# EAGLE design rgbLightsController (EAGLE 8.6.3)
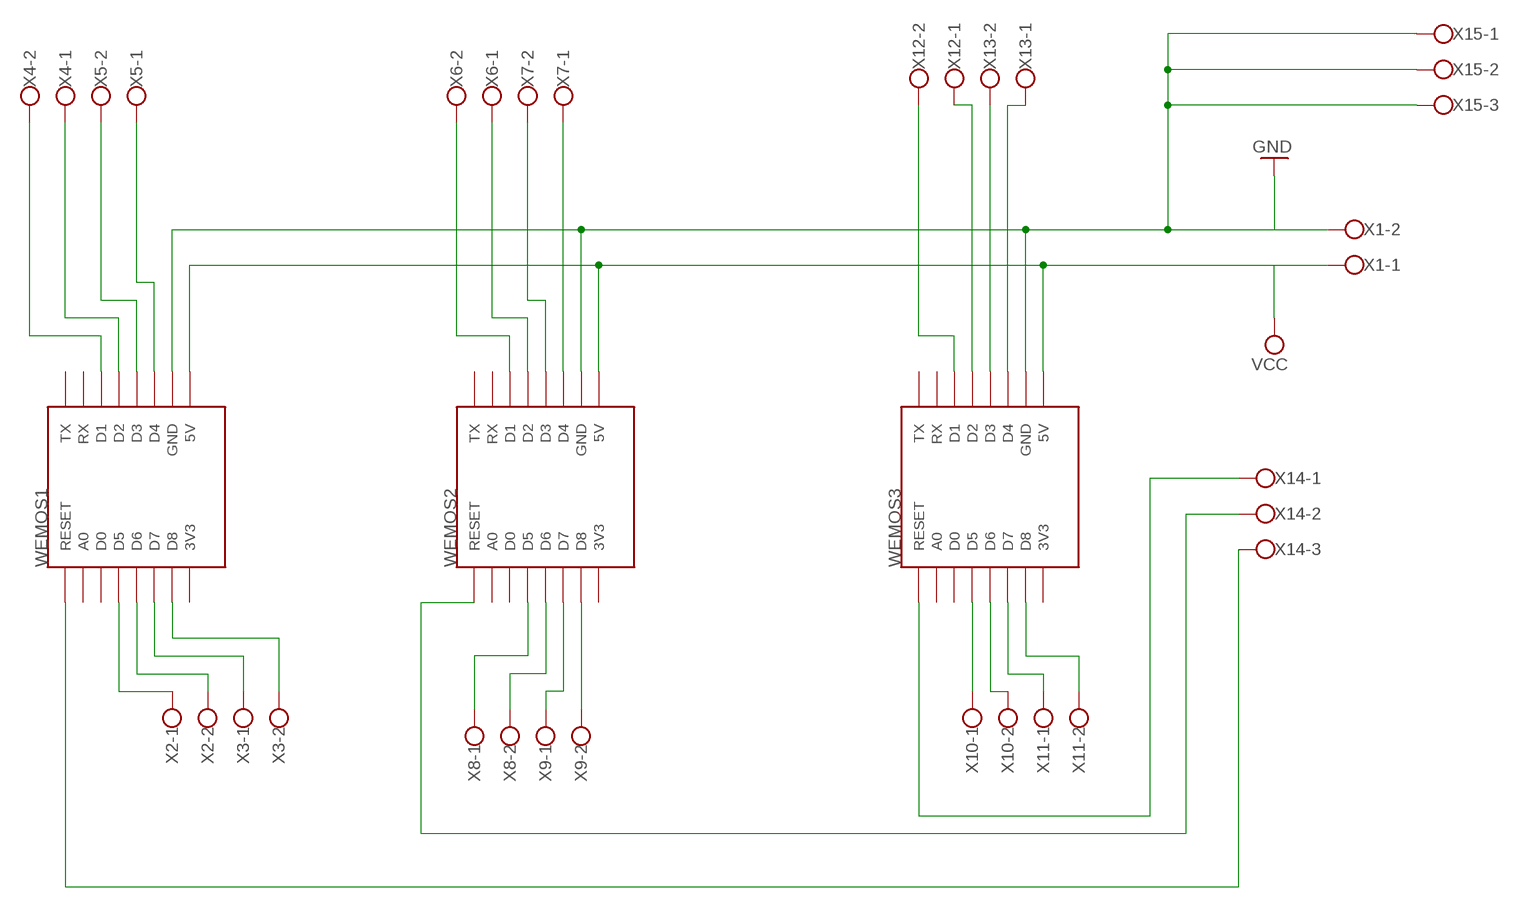
[diagram p0: schematic, sheet 1]

## Parts
WEMOS1  WEMOS-D1-MINI  [WEMOS-D1-MINI]
WEMOS2  WEMOS-D1-MINI  [WEMOS-D1-MINI]
WEMOS3  WEMOS-D1-MINI  [WEMOS-D1-MINI]
X1  W237-102  [W237-102]
X2  W237-102  [W237-102]
X3  W237-102  [W237-102]
X4  W237-102  [W237-102]
X5  W237-102  [W237-102]
X6  W237-102  [W237-102]
X7  W237-102  [W237-102]
X8  W237-102  [W237-102]
X9  W237-102  [W237-102]
X10  W237-102  [W237-102]
X11  W237-102  [W237-102]
X12  W237-102  [W237-102]
X13  W237-102  [W237-102]
X14  W237-103  [W237-103]
X15  W237-103  [W237-103]

## Nets
GND: WEMOS1.GND WEMOS2.GND WEMOS3.GND X1.2 X15.1 X15.2 X15.3
N$1: WEMOS2.D1 X6.2
N$2: WEMOS2.D2 X6.1
N$3: WEMOS1.D1 X4.2
N$4: WEMOS1.D2 X4.1
N$5: WEMOS1.D3 X5.2
N$6: WEMOS1.D4 X5.1
N$7: WEMOS2.D3 X7.2
N$8: WEMOS2.D4 X7.1
N$9: WEMOS3.D1 X12.2
N$10: WEMOS3.D2 X12.1
N$11: WEMOS3.D3 X13.2
N$12: WEMOS3.D4 X13.1
N$13: WEMOS1.D5 X2.1
N$14: WEMOS1.D6 X2.2
N$15: WEMOS1.D7 X3.1
N$16: WEMOS1.D8 X3.2
N$17: WEMOS2.D5 X8.1
N$18: WEMOS2.D6 X8.2
N$19: WEMOS2.D7 X9.1
N$20: WEMOS2.D8 X9.2
N$21: WEMOS3.D5 X10.1
N$22: WEMOS3.D6 X10.2
N$23: WEMOS3.D7 X11.1
N$24: WEMOS3.D8 X11.2
N$25: WEMOS2.RESET X14.2
N$26: WEMOS1.RESET X14.3
N$27: X14.1
VCC: WEMOS1.5V WEMOS2.5V WEMOS3.5V X1.1
Unconnected: WEMOS1.3V3 WEMOS1.A0 WEMOS1.D0 WEMOS1.RX WEMOS1.TX WEMOS2.3V3 WEMOS2.A0 WEMOS2.D0 WEMOS2.RX WEMOS2.TX WEMOS3.3V3 WEMOS3.A0 WEMOS3.D0 WEMOS3.RESET WEMOS3.RX WEMOS3.TX

## Library data of the parts
WEMOS1-WEMOS3 = esp8266modules:WEMOS-D1-MINI: WeMos.cc D1 mini ESP8266 module
X1-X13 = con-wago-500:W237-102: WAGO SCREW CLAMP; MPN: 237-102; OC_FARNELL: unknown; OC_NEWARK: 70K9898
X14 X15 = con-wago-500:W237-103: WAGO SCREW CLAMP; MPN: 237-103; OC_FARNELL: unknown; OC_NEWARK: 18M7116

## Net classes
0 default: width 0.203 mm, drill 0.356 mm, clearance 0.152 mm

## Board
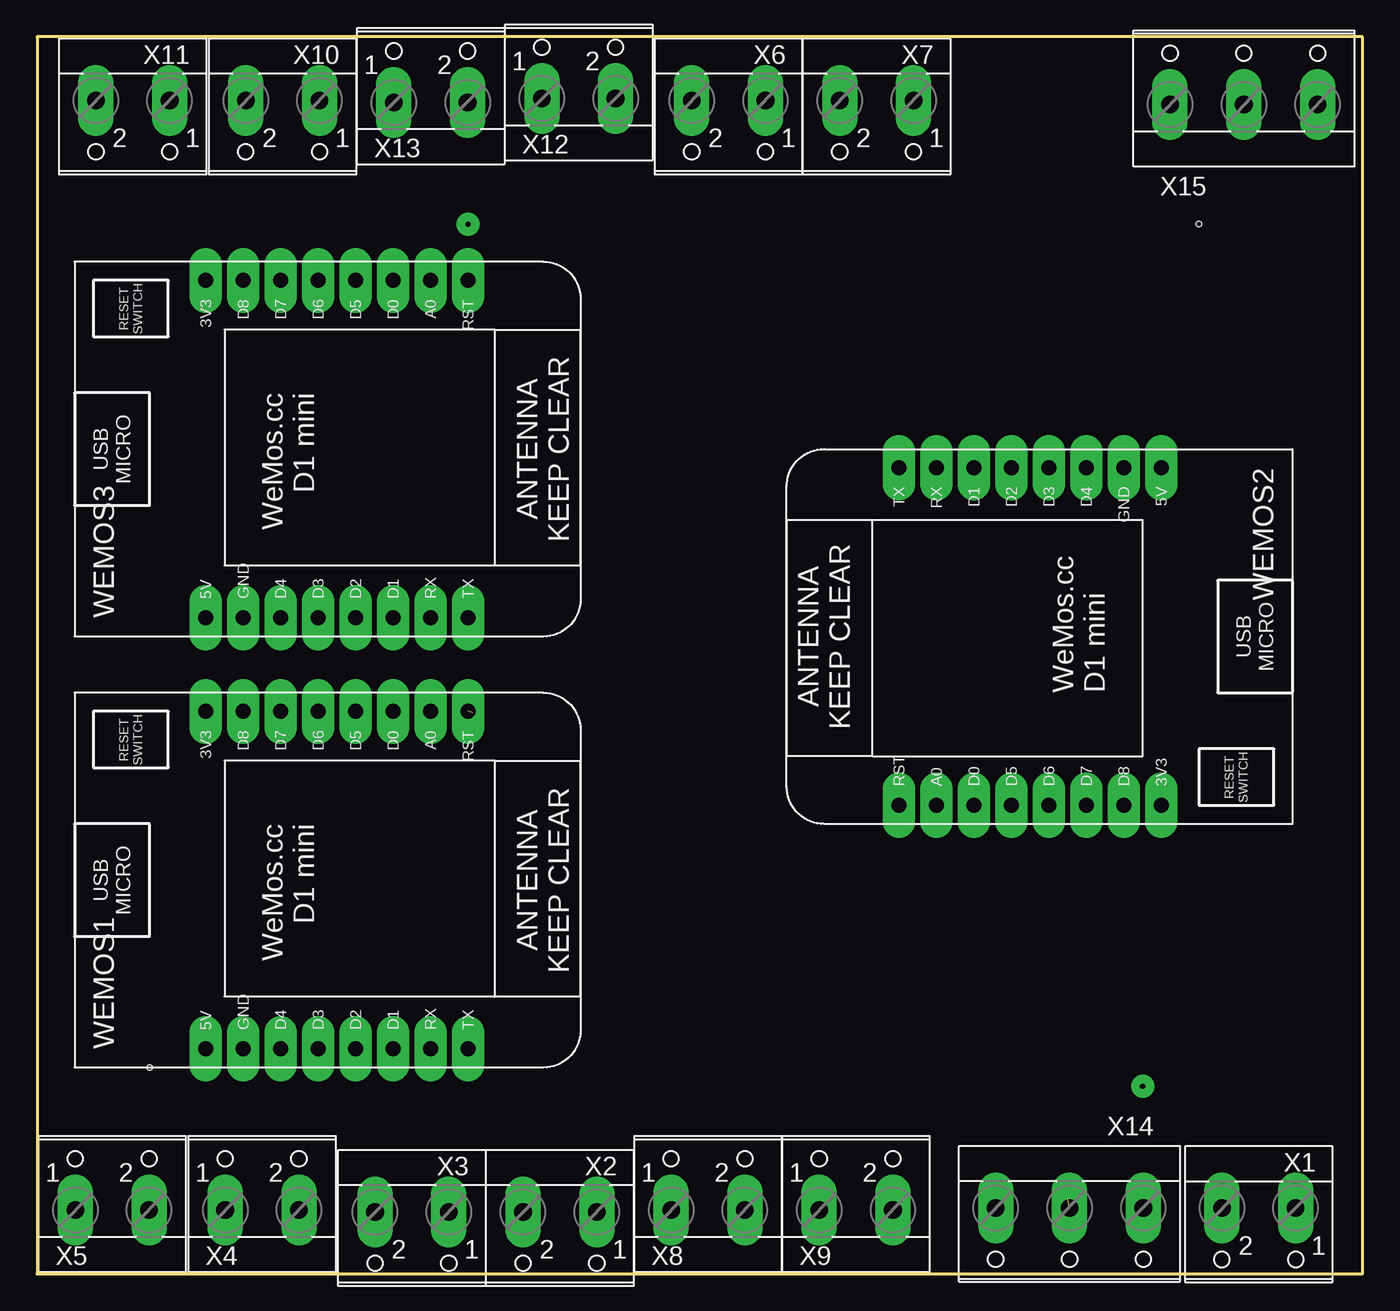
[diagram p1: board, top side]
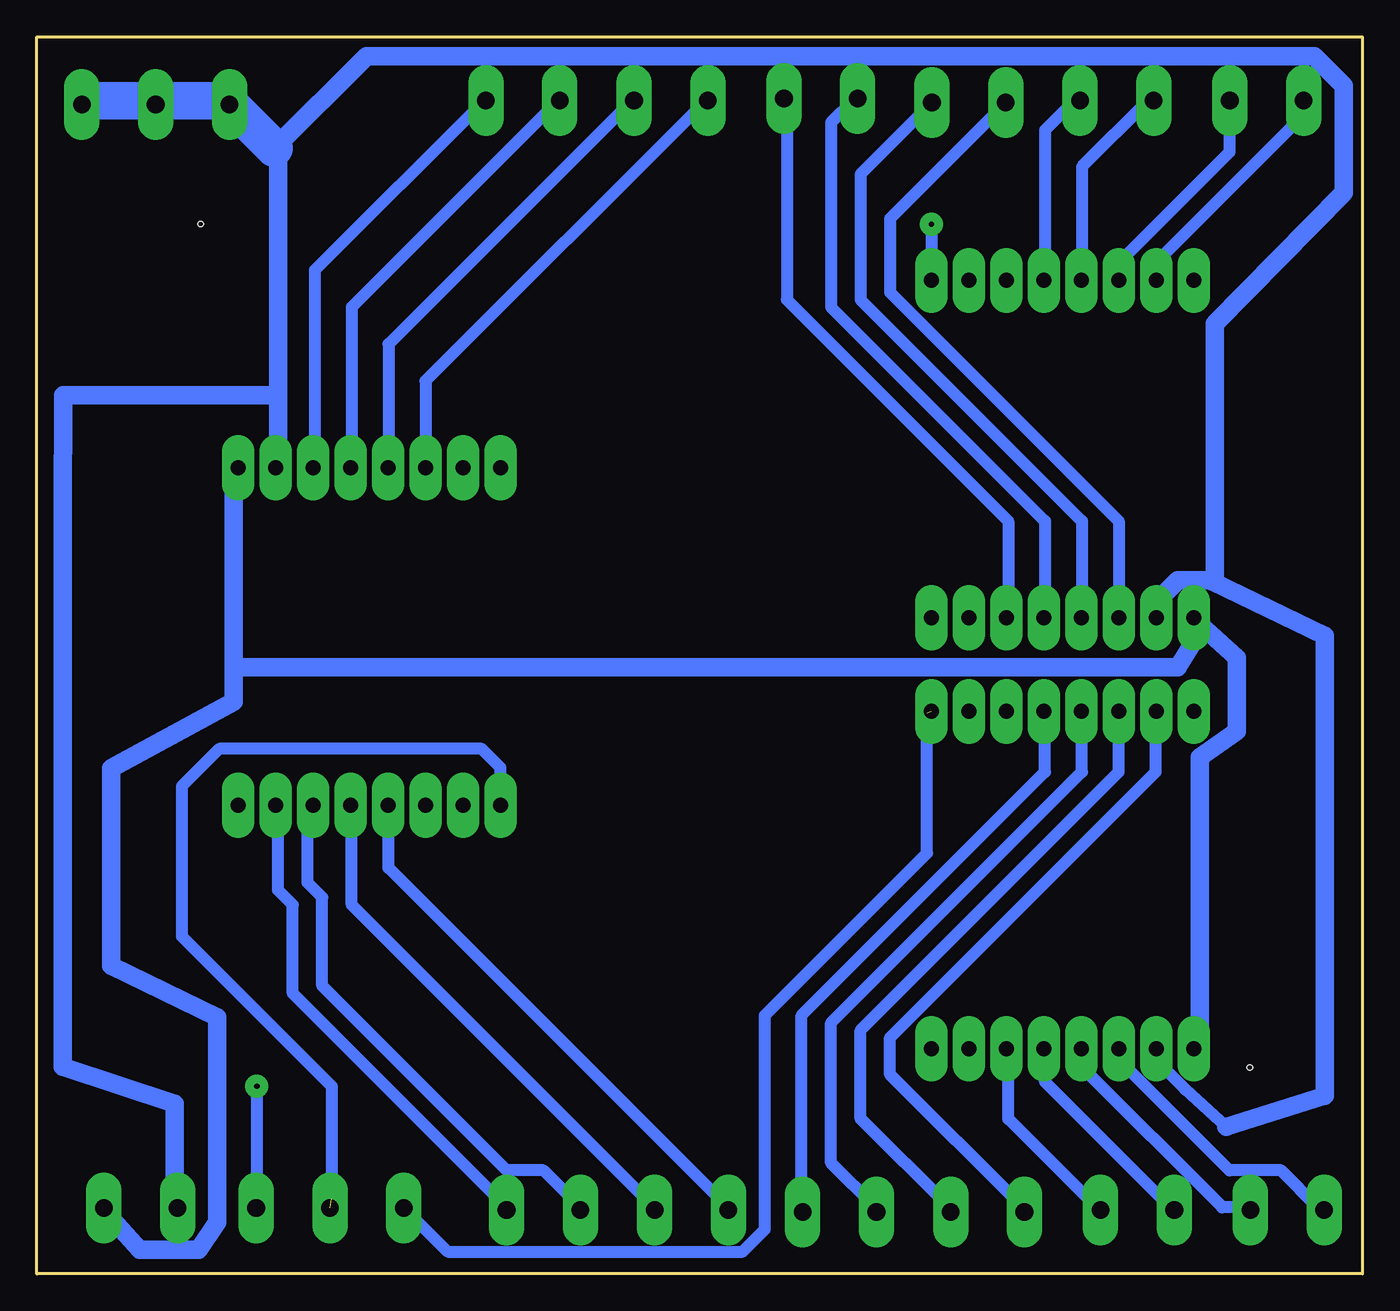
[diagram p2: board, bottom side, seen from below]

Size 89.84 x 83.81 mm. Coordinates in mm from the lower left corner, seen from the top.
Outline: 0,0 89.84,0 89.84,83.81 0,83.81 0,0
Copper layers (1*16): Top 0.035mm / dielectric 1.5mm / Bottom 0.035mm
Design rules "hobby": minimum track width 0.8mm, minimum drill 0.8mm, track to track 0.8mm, track to pad 0.8mm, pad to pad 0.45mm, via to via 0.8mm, smd to smd 8mil, copper to edge 10mil, drill to drill 8mil, minimum pad ring 0.6mm, minimum via ring 0.6mm, stop-mask expansion 0mil, vias tented up to drill 0mil, thermal gap 10mil
Holes 0.35 mm at 7.62,13.97 78.74,71.12

### Footprints (pad centres in the part's own frame; a part is rotated, then mirrored left to right if it is on the bottom)
WEMOS-D1-MINI = drill 1.016 pad 1.829 long: 3V3 -10.16,-10.16; 5V 12.7,-10.16; A0 -10.16,5.08; D0 -10.16,2.54; D1 12.7,2.54; D2 12.7,0; D3 12.7,-2.54; D4 12.7,-5.08; D5 -10.16,0; D6 -10.16,-2.54; D7 -10.16,-5.08; D8 -10.16,-7.62; GND 12.7,-7.62; RESET -10.16,7.62; RX 12.7,5.08; TX 12.7,7.62
W237-102 = drill 1.194 long: 1 -2.5,-1.27; 2 2.5,-1.27
W237-103 = drill 1.194 long: 1 -5,-1.29; 2 0,-1.29; 3 5,-1.29

### Placement (x,y rotation side)
WEMOS1  21.59,27.94 270 top
WEMOS2  66.04,41.91 90 top
WEMOS3  21.59,57.15 270 top
X1  82.8,3.17 180 top
X2  35.43,2.92 180 top
X3  25.4,2.92 180 top
X4  15.24,5.59 0 top
X5  5.08,5.59 0 top
X6  46.86,78.23 180 top
X7  56.9,78.23 180 top
X8  45.47,5.59 0 top
X9  55.5,5.59 0 top
X10  16.64,78.23 180 top
X11  6.48,78.23 180 top
X12  36.7,80.9 0 top
X13  26.67,80.64 0 top
X14  69.98,3.17 180 top
X15  81.79,80.52 0 top

### Tracks (layer width: path | path; a pad name or v marks a point on that pad's centre or on a via)
GND
  Bottom 0.8: 9.23,9.96 12,12.5 14,14.5 14,15 WEMOS1.GND | 10.5,47 10.12,46.88 10,47 | 82,79.5 X15.2 81.5,79.5 | 86.5,79.5 X15.3 | 73.75,76.25 73.5,76 | 73.5,55 WEMOS2.GND | 76.5,79 X15.1 77,79.5 | 80.5,4.5 X1.2
  Bottom 1.27: 9.23,9.96 2.56,12.06 2.56,43.25 10.12,46.88 | 10.5,47 12.5,47 14,45.5 14,44.5 WEMOS3.GND | 73.5,76 73.5,59.54 | 73.5,59.54 73.5,55 | 80.5,4.5 80.5,11.53 88.08,14.03 88.08,51.5 88.04,59.54 73.5,59.54 | 10,47 10,64.36 1.25,73.25 1.25,80.5 3.25,82.5 67.5,82.5 73.75,76.25
  Bottom 2.54: 86.5,79.5 82,79.5 | 76.5,79 73.75,76.25 | 77,79.5 81.5,79.5
N$1
  Bottom 0.8: WEMOS2.D1 63.5,60.5 44.5,79.5 X6.2
N$2
  Bottom 0.8: WEMOS2.D2 66,55 66,63 49.5,79.5 X6.1
N$3
  Bottom 0.8: WEMOS1.D1 24,15 24,10.5 18,4.5 X4.2
N$4
  Bottom 0.8: WEMOS1.D2 21.5,15 21.5,13 13,4.5 X4.1
N$5
  Bottom 0.8: WEMOS1.D3 19,15 19,14 9.5,4.5 8,4.5 X5.2
N$6
  Bottom 0.8: WEMOS1.D4 16.5,15 16.5,14.5 9,7 5.5,7 3,4.5 X5.1
N$7
  Bottom 0.8: WEMOS2.D3 68.5,55 68.5,65.5 54.5,79.5 X7.2
N$8
  Bottom 0.8: WEMOS2.D4 71,55 71,68 59.5,79.5 X7.1
N$9
  Bottom 0.8: WEMOS3.D1 24,44.5 24,51 39,66 39,79.5 X12.2
N$10
  Bottom 0.8: WEMOS3.D2 21.5,44.5 21.5,51 36,65.5 36,78 34.5,79.5 X12.1
N$11
  Bottom 0.8: WEMOS3.D3 19,44.5 19,51 34,66 34,74.5 29.5,79 X13.2
N$12
  Bottom 0.8: WEMOS3.D4 16.5,44.5 16.5,51 32,66.5 32,71.5 24.5,79 X13.1
N$13
  Bottom 0.8: WEMOS1.D5 21.5,38 21.5,34 38,17.5 38,4.5 X2.1
N$14
  Bottom 0.8: WEMOS1.D6 19,38 19,34 36,17 36,7.5 33,4.5 X2.2
N$15
  Bottom 0.8: WEMOS1.D7 16.5,38 16.5,34 34,16.5 34,10.5 28,4.5 X3.1
N$16
  Bottom 0.8: WEMOS1.D8 14,38 14,34 32,16 32,13.5 23,4.5 X3.2
N$17
  Bottom 0.8: WEMOS2.D5 66,31.5 66,27.5 43,4.5 X8.1
N$18
  Bottom 0.8: WEMOS2.D6 68.5,31.5 68.5,25 48,4.5 X8.2
N$19
  Bottom 0.8: WEMOS2.D7 71,31.5 71,31 71.5,30.5 71.5,26.5 70.5,25.5 70.5,19.5 58,7 55.5,7 53,4.5 X9.1
N$20
  Bottom 0.8: WEMOS2.D8 73.5,31.5 73.5,26 72.5,25 72.5,19 58,4.5 X9.2
N$21
  Bottom 0.8: WEMOS3.D5 21.5,67.5 21.5,77.5 19.5,79.5 X10.1
N$22
  Bottom 0.8: WEMOS3.D6 19,67.5 19,75 14.5,79.5 X10.2
N$23
  Bottom 0.8: WEMOS3.D7 16.5,67.5 16.5,68.5 9,76 9,79.5 X11.1
N$24
  Bottom 0.8: WEMOS3.D8 14,67.5 14,68.5 4,78.5 4,79.5 X11.2
N$25  (1 unrouted)
  Bottom 0.813: WEMOS2.RESET 58.42,34.29 59.69,35.56 77.47,35.56 80.01,33.02 80.01,22.86 69.85,12.7 69.85,5.08
N$26  (1 unrouted)
  Bottom 0.8: 29.5,38 29.5,28.5 40.5,17.5 40.5,3 42,1.5 62,1.5 64.5,4 X14.3
N$27
  Bottom 0.8: 75,4.5 X14.1 74.5,4.5
N$28  (via drill 0.35)
  Bottom 0.813: v29.21,71.12 29.21,67.31
N$29  (via drill 0.35)
  Bottom 0.813: v74.93,12.7 74.93,5.08
VCC
  Bottom 0.8: 11,15.5 WEMOS1.5V | 76.5,54.5 WEMOS2.5V | 85,4 X1.1 | 11,43.5 WEMOS3.5V
  Bottom 1.27: 11,15.5 11,35 8.49,36.75 8.49,41.75 11,44 WEMOS3.5V | 76.5,41.11 76.5,38.77 84.81,34.27 84.81,20.88 77.63,17.38 77.63,3.5 78.87,1.62 82.87,1.62 85,4 | 76.5,41.11 76.5,54.5 | 11,43.5 12.5,41.11 76.5,41.11
(copper drawn outside any net)
  shapes: Top area x1